# Altium schematic sheet Receiver.SchDoc
size A
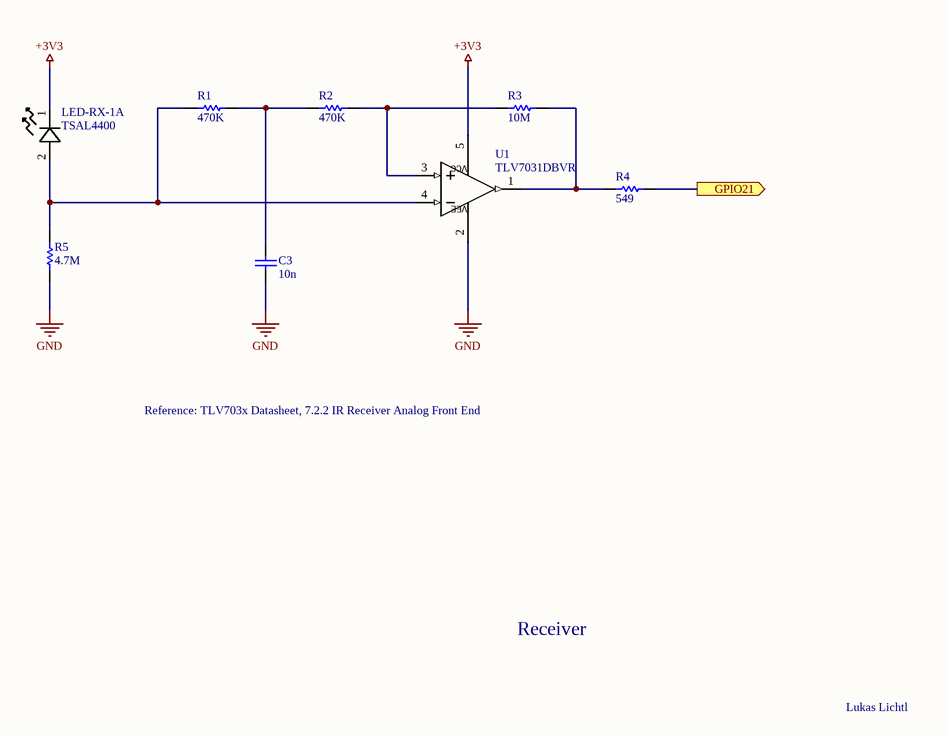
[diagram p0: Receiver.SchDoc]

## Parts
C3  10n  [CAPC1608X90X35LL15T15]
LED-RX-1  TSAL4400  [LED_RADIAL_TSAL4400]  (part A of 4)
R1  470K  [RESC1608X55X25NL10T15]
R2  470K  [RESC1608X55X25NL10T15]
R3  10M  [RESC1608X55X25NL10T15]
R4  549  [RESC1608X55X25NL10T15]
R5  4.7M  [RESC1608X55X25NL10T15]
U1  TLV7031DBVR  [DBV0005A_N]

## Ports
GPIO21 (out)

## Nets
+3V3: LED-RX-1.1(CAHTODE) U1.5(VCC)
GND: C3.1 R5.2 U1.2(VEE)
GPIO21: R4.2 ; port GPIO21
NetC3_2: C3.2 R1.2 R2.1
NetLED-RX-1_2: LED-RX-1.2(ANODE) R1.1 R5.1 U1.4(IN-)
NetR2_2: R2.2 R3.1 U1.3(IN+)
NetR3_2: R3.2 R4.1 U1.1(OUT)

## Notes on the sheet
- Reference: TLV703x Datasheet, 7.2.2 IR Receiver Analog Front End
- Receiver
- Lukas Lichtl

## Library data of the parts
C3 = CMP-2006-02133-1: Manufacturer: AVX Interconnect / Elco; Part Number: 0603ZC101KAT2A
LED-RX-1 = TSAL4400: Description; Manufacturer_Name: Vishay Semiconductors; Type: LED Indication; Copyright: Copyright (C) 2025 Ultra Librarian. All rights reserved.; Manufacturer_Part_Number: TSAL4400
R1-R5 = CMP-2000-04082-1: Manufacturer: Yageo; Part Number: RC0603FR-07549RL
U1 = TLV7031DBVR: Nanopower, small size comparator with push-pull output 5-SOT-23 -40 to 125; Manufacturer_Name: Texas Instruments; TYPE: TYPE; RefDes: RefDes; Copyright: Copyright (C) 2026 Ultra Librarian. All rights reserved.; Manufacturer_Part_Number: TLV7031DBVR